# Altium schematic sheet power-unit.SchDoc
size 297 x 209 mm; SheetNumber: 1; SheetTotal: 1; SPICEModelCacheNNYHQYXK: <root> / <DocumentId>NNYHQYXK</DocumentId> / </root>
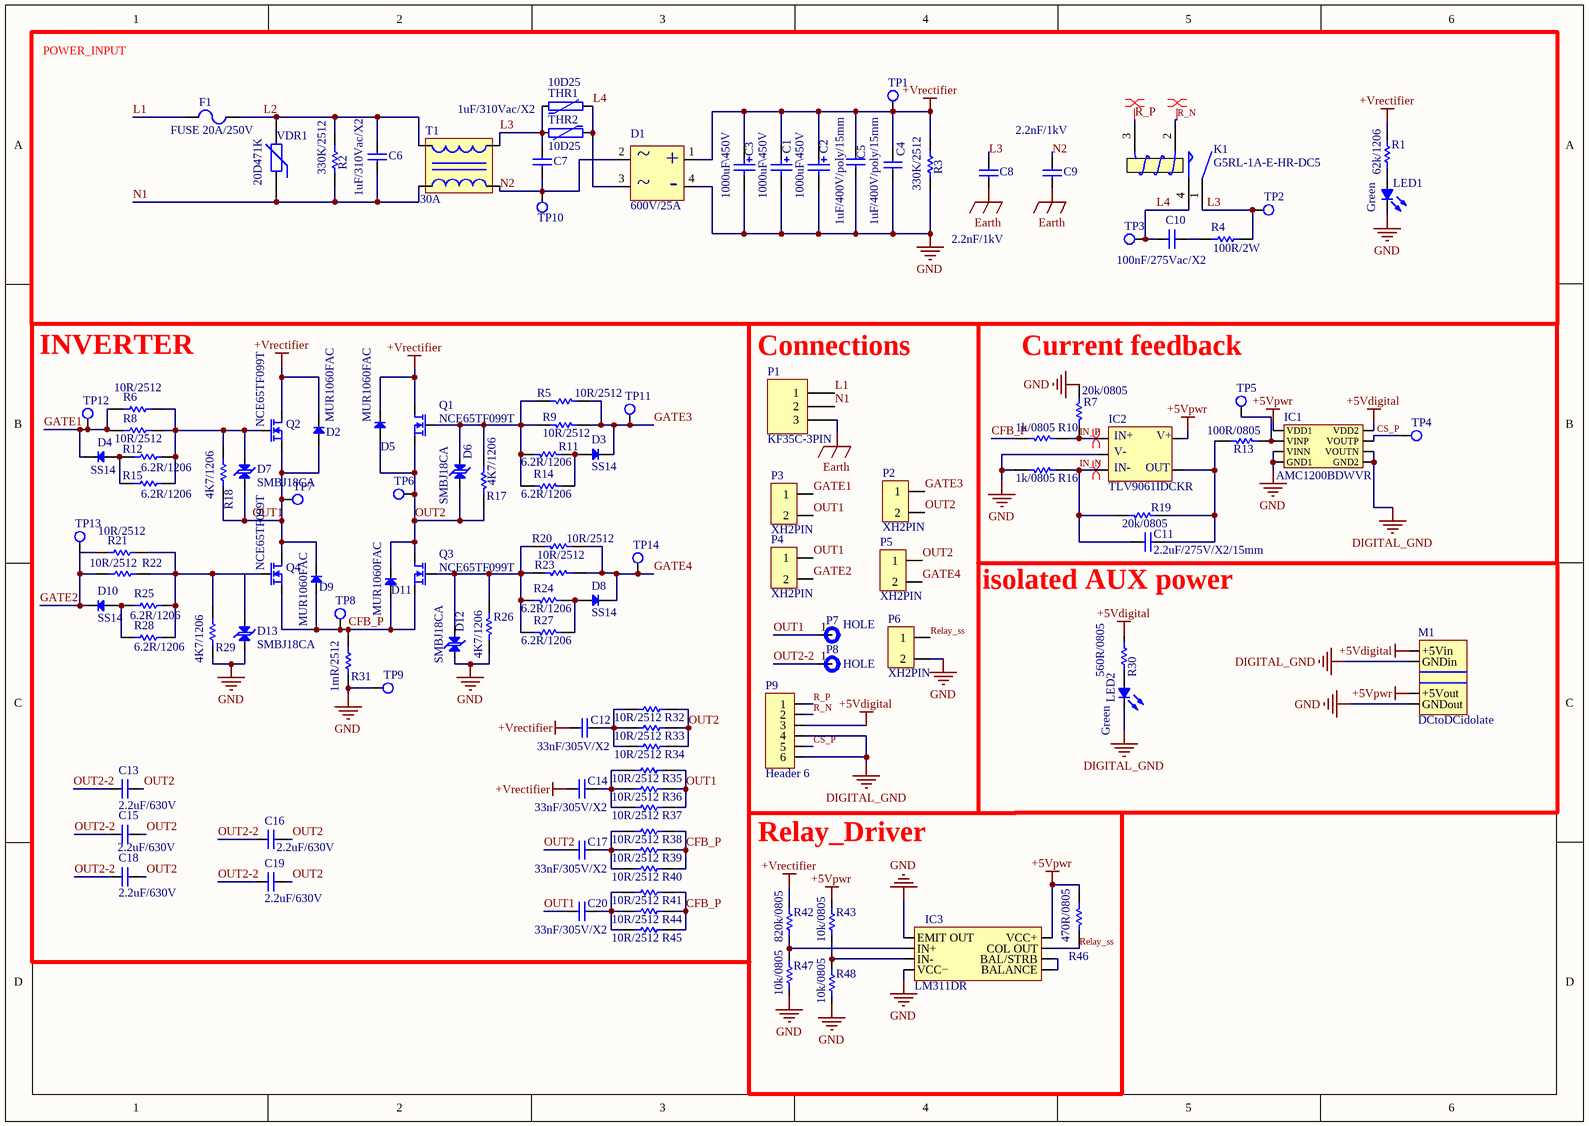
[diagram p0: power-unit.SchDoc]

## Parts
C1  1000uF\450V  [Capacitor 36*72 p=10]
C2  1000uF\450V  [Capacitor 36*72 p=10]
C3  1000uF\450V  [Capacitor 36*72 p=10]
C4  1uF/400V/poly/15mm  [cap poly 20mm]
C5  1uF/400V/poly/15mm  [cap poly 20mm]
C6  1uF/310Vac/X2  [1uF/310VAC/X@/22.5mm]
C7  1uF/310Vac/X2  [1uF/310VAC/X@/22.5mm]
C8  2.2nF/1kV  [1nF/1KV]
C9  2.2nF/1kV  [1nF/1KV]
C10  100nF/275Vac/X2  [0.1uF/275VAC/X@/15mm]
C11  2.2uF/275V/X2/15mm  [CAP 0805]
C12  33nF/305V/X2  [33nF/305V/X2]
C13  2.2uF/630V  [18x32 p=27.5]
C14  33nF/305V/X2  [33nF/305V/X2]
C15  2.2uF/630V  [18x32 p=27.5]
C16  2.2uF/630V  [18x32 p=27.5]
C17  33nF/305V/X2  [33nF/305V/X2]
C18  2.2uF/630V  [18x32 p=27.5]
C19  2.2uF/630V  [18x32 p=27.5]
C20  33nF/305V/X2  [33nF/305V/X2]
D1  600V/25A  [D25XB60]
D2  MUR1060FAC  [TO-220F-AC]
D3  SS14  [SMA]
D4  SS14  [SMA]
D5  MUR1060FAC  [TO-220F-AC]
D6  SMBJ18CA  [SMB(DO-214AA)]
D7  SMBJ18CA  [SMB(DO-214AA)]
D8  SS14  [SMA]
D9  MUR1060FAC  [TO-220F-AC]
D10  SS14  [SMA]
D11  MUR1060FAC  [TO-220F-AC]
D12  SMBJ18CA  [SMB(DO-214AA)]
D13  SMBJ18CA  [SMB(DO-214AA)]
F1  FUSE 20A/250V  [Fuse - Complex]
IC1  AMC1200BDWVR  [SOIC8-AMC1200]
IC2  TLV9061IDCKR  [SC70-5]
IC3  LM311DR  [SOIC-8]
K1  G5RL-1A-E-HR-DC5  [G5RL-1A-E-HR-DC5]
LED1  COLOR: Green  [LED 3mm]  (hidden comment: LED 3mm/Green)
LED2  COLOR: Green  [LED 3mm]  (hidden comment: LED 3mm/Green)
M1  DCtoDCidolate  [dctodc]
P1  KF35C-3PIN  [KF35C-3PIN]
P2  XH2PIN  [XH-2Pin]
P3  XH2PIN  [XH-2Pin]
P4  XH2PIN  [XH-2Pin]
P5  XH2PIN  [XH-2Pin]
P6  XH2PIN  [XH-2Pin]
P7  HOLE  [Plugin PCB Welding Terminal]
P8  HOLE  [Plugin PCB Welding Terminal]
P9  Header 6  [controller_board]
Q1  NCE65TF099T  [TO-247]
Q2  NCE65TF099T  [TO-247]
Q3  NCE65TF099T  [TO-247]
Q4  NCE65TF099T  [TO-247]
R1  62k/1206  [RES 1206]
R2  330K/2512  [RES 2512]
R3  330K/2512  [RES 2512]
R4  100R/2W  [RES AXIAL 700]
R5  10R/2512  [RES 2512]
R6  10R/2512  [RES 2512]
R7  20k/0805  [RES 0805]
R8  10R/2512  [RES 2512]
R9  10R/2512  [RES 2512]
R10  1k/0805  [RES 0805]
R11  6.2R/1206  [RES 1206]
R12  6.2R/1206  [RES 1206]
R13  100R/0805  [RES 0805]
R14  6.2R/1206  [RES 1206]
R15  6.2R/1206  [RES 1206]
R16  1k/0805  [RES 0805]
R17  4K7/1206  [RES 1206]
R18  4K7/1206  [RES 1206]
R19  20k/0805  [RES 0805]
R20  10R/2512  [RES 2512]
R21  10R/2512  [RES 2512]
R22  10R/2512  [RES 2512]
R23  10R/2512  [RES 2512]
R24  6.2R/1206  [RES 1206]
R25  6.2R/1206  [RES 1206]
R26  4K7/1206  [RES 1206]
R27  6.2R/1206  [RES 1206]
R28  6.2R/1206  [RES 1206]
R29  4K7/1206  [RES 1206]
R30  560R/0805  [RES 0805]
R31  1mR/2512  [RES 2512]
R32  10R/2512  [RES 2512]
R33  10R/2512  [RES 2512]
R34  10R/2512  [RES 2512]
R35  10R/2512  [RES 2512]
R36  10R/2512  [RES 2512]
R37  10R/2512  [RES 2512]
R38  10R/2512  [RES 2512]
R39  10R/2512  [RES 2512]
R40  10R/2512  [RES 2512]
R41  10R/2512  [RES 2512]
R42  820k/0805  [RES 0805]
R43  10k/0805  [RES 0805]
R44  10R/2512  [RES 2512]
R45  10R/2512  [RES 2512]
R46  470R/0805  [RES 0805]
R47  10k/0805  [RES 0805]
R48  10k/0805  [RES 0805]
T1  30A  [EMI-TRANS-20A]
THR1  10D25  [10D25]
THR2  10D25  [10D25]
TP1  (no value)  [TP]
TP2  (no value)  [TP]
TP3  (no value)  [TP]
TP4  (no value)  [TP]
TP5  (no value)  [TP]
TP6  (no value)  [TP]
TP7  (no value)  [TP]
TP8  (no value)  [TP]
TP9  (no value)  [TP]
TP10  (no value)  [TP]
TP11  (no value)  [TP]
TP12  (no value)  [TP]
TP13  (no value)  [TP]
TP14  (no value)  [TP]
VDR1  20D471K  [20D471K]

## Blocks framed on the sheet
POWER_INPUT: C1-C10 D1 F1 K1 LED1 R1-R4 T1 THR1 THR2 TP1-TP3 TP10 VDR1

## Nets
+5Vdigital: IC1.8(VDD2) M1.1(+5Vin) P9.3 R30.2
+5Vpwr: IC1.1(VDD1) IC2.5 IC3.8(VCC+) M1.3(+5Vout) R43.2 R46.2
+Vrectifier: C1.1 C2.1 C3.1 C4.2(-) C5.2(-) C12.1(+) C14.1(+) D1.1 D2.2 D5.2 Q1.2(D) Q2.2(D) R1.2 R3.2 R42.2 TP1.1
DIGITAL_GND: IC1.5(GND2) IC1.6(VOUTN) LED2.2(K) M1.2(GNDin) P9.4 P9.6
Earth: C8.1(+) C9.1(+) P1.3
GND: C1.2 C2.2 C3.2 C4.1(+) C5.1(+) D1.4 D12.1 D13.2 IC1.3(VINN) IC1.4(GND1) IC2.2 IC3.1(EMIT_OUT) IC3.4(VCC−) LED1.2(K) M1.4(GNDout) P6.2 R3.1 R7.1 R16.2 R26.2 R29.2 R31.2 R47.1 R48.1 TP9.1
CFB_P: D9.1 D11.1 Q3.3(S) Q4.3(S) R10.2 R31.1 R38.1 R39.1 R40.1 R41.1 R44.1 R45.1 TP8.1
CS_P: IC1.7(VOUTP) P9.5 TP4.1
GATE1: D4.2 P3.1 R6.1 R8.1 TP12.1
GATE2: D10.2 P4.2 R21.1 R22.1 TP13.1
GATE3: D3.2 P2.1 R5.1 R9.1 TP11.1
GATE4: D8.2 P5.2 R20.1 R23.1 TP14.1
IN_N: C11.1(+) IC2.3 R16.1 R19.1
IN_P: IC2.1 R7.2 R10.1
L1: F1.2 P1.1
L2: C6.1(+) F1.1 R2.2 T1.1 VDR1.2
L3: C7.2(-) C8.2(-) K1.1(COM) R4.1 T1.4 THR1.1 THR2.2 TP2.1
L4: C10.1(+) D1.3 K1.4(NO) THR1.2 THR2.1 TP3.1
N1: C6.2(-) P1.2 R2.1 T1.2 VDR1.1
N2: C7.1(+) C9.2(-) D1.2 T1.3 TP10.1
OUT1: C20.1(+) D2.1 D7.2 D9.2 P3.2 P4.1 P7.1 Q2.3(S) Q4.2(D) R18.2 R35.1 R36.1 R37.1 TP7.1
OUT2: C13.2(-) C15.2(-) C16.2(-) C17.1(+) C18.2(-) C19.2(-) D5.1 D6.2 D11.2 P2.2 P5.1 Q1.3(S) Q3.2(D) R17.2 R32.1 R33.1 R34.1 TP6.1
OUT2-2: C13.1(+) C15.1(+) C16.1(+) C18.1(+) C19.1(+) P8.1
R_N: K1.2(T1) P9.2
R_P: K1.3(T2) P9.1
Relay_ss: IC3.7(COL_OUT) P6.1 R46.1
NetC10_2: C10.2(-) R4.2
NetC11_2: C11.2(-) IC2.4 R13.2 R19.2
NetC12_2: C12.2(-) R32.2 R33.2 R34.2
NetC14_2: C14.2(-) R35.2 R36.2 R37.2
NetC17_2: C17.2(-) R38.2 R39.2 R40.2
NetC20_2: C20.2(-) R41.2 R44.2 R45.2
NetD3_1: D3.1 R11.1 R14.2
NetD4_1: D4.1 R12.1 R15.1
NetD6_1: D6.1 Q1.1(G) R5.2 R9.2 R11.2 R14.1 R17.1
NetD7_1: D7.1 Q2.1(G) R6.2 R8.2 R12.2 R15.2 R18.1
NetD8_1: D8.1 R24.1 R27.1
NetD10_1: D10.1 R25.1 R28.2
NetD12_2: D12.2 Q3.1(G) R20.2 R23.2 R24.2 R26.1 R27.2
NetD13_1: D13.1 Q4.1(G) R21.2 R22.2 R25.2 R28.1 R29.1
NetIC1_2: IC1.2(VINP) R13.1 TP5.1
NetIC3_2: IC3.2(IN+) R42.1 R47.2
NetIC3_3: IC3.3(IN-) R43.1 R48.2
NetIC3_5: IC3.5(BALANCE) IC3.6(BAL/STRB)
NetLED1_1: LED1.1(A) R1.1
NetLED2_1: LED2.1(A) R30.1

## Layout directives
differential pair: IN_N, IN_P, R_N, R_P

## Notes on the sheet
- INVERTER
- (near P1) Connections
- Current feedback
- (near C11) isolated AUX power
- Relay_Driver
- (in symbol br-diode) ~; +; -
- (in symbol TLV9061IDCKR) IN+; V+; V-; IN-; OUT

## Library data of the parts
C1-C3 = Cap Pol1: Polarized Capacitor (Radial); Published: 8-Jun-2000; LatestRevisionDate: 17-Jul-2002; LatestRevisionNote: Re-released for DXP Platform.; PackageReference: RB7.6-15; Publisher: Altium Limited; PackageDescription: Polarized Capacitor (Radial); 2 Leads; Value: 1000uF\450V
C4-C20 = Capacitor
D1 = br-diode
D2-D5 D8-D11 = Diode
D6 D7 D12 D13 = TVS-BIPOLAR: 18v-20A
F1 = Fuse
IC1 = AMC1200BDWVR: isolate op-amp g = 8
K1 = RELAY-4C: SPDT Relay; Published: 8-Jun-2000; LatestRevisionDate: 17-Jul-2002; LatestRevisionNote: Re-released for DXP Platform.; PackageReference: MODULE5B; Publisher: Altium Limited
LED1 LED2 = LED: Typical LED
P1 = Header 3: LatestRevisionDate: 17-Jul-2002; LatestRevisionNote: Re-released for DXP Platform.; Publisher: Altium Limited
P2-P6 = Header 2H: RELAY; LatestRevisionDate: 17-Jul-2002; LatestRevisionNote: Re-released for DXP Platform.; Publisher: Altium Limited
Q1-Q4 = Mosfet N-channel
R1-R3 R30 R42 R43 R47 R48 = Res
  R1: value: 62k/1206
  R2 R3: value: 330K/2512
  R30: value: 560R/0805
  R42: value: 820k/0805
  R43 R47 R48: value: 10k/0805
R4 R32-R41 R44 R45 = Res 0.5 W
  R4: value: 100R/2W
  R32-R41 R44 R45: value: 10R/2512
R5-R29 R31 R46 = Res1: Resistor; Published: 8-Jun-2000; LatestRevisionDate: 17-Jul-2002; LatestRevisionNote: Re-released for DXP Platform.; PackageReference: AXIAL-0.3; Publisher: Altium Limited; PackageDescription: Axial Device, Thru-Hole; 2 Leads; 0.3 in Pin Spacing
  R5 R6 R8 R9 R20-R23: Value: 10R/2512
  R7 R19: Value: 20k/0805
  R10 R16: Value: 1k/0805
  R11 R12 R14 R15 R24 R25 R27 R28: Value: 6.2R/1206
  R13: Value: 100R/0805
  R17 R18 R26 R29: Value: 4K7/1206
  R31: Value: 1mR/2512
  R46: Value: 470R/0805
T1 = Line Filter_01: Line Filter
THR1 THR2 = NTC
TP1-TP14 = test-point
VDR1 = VARISTOR (VDR): VARISTORS; Manufacturer: china-canada-philipina; Designer: Abbas Basereh; VALUE: xxDxxx; Models: MOV-VDR-COV; Data: 2017-1-5; Link: digikey.com; PUBLISHER: ABBAS BASEREH